# Altium schematic sheet CHANNEL_RELAY_CARD.SchDoc
size A4
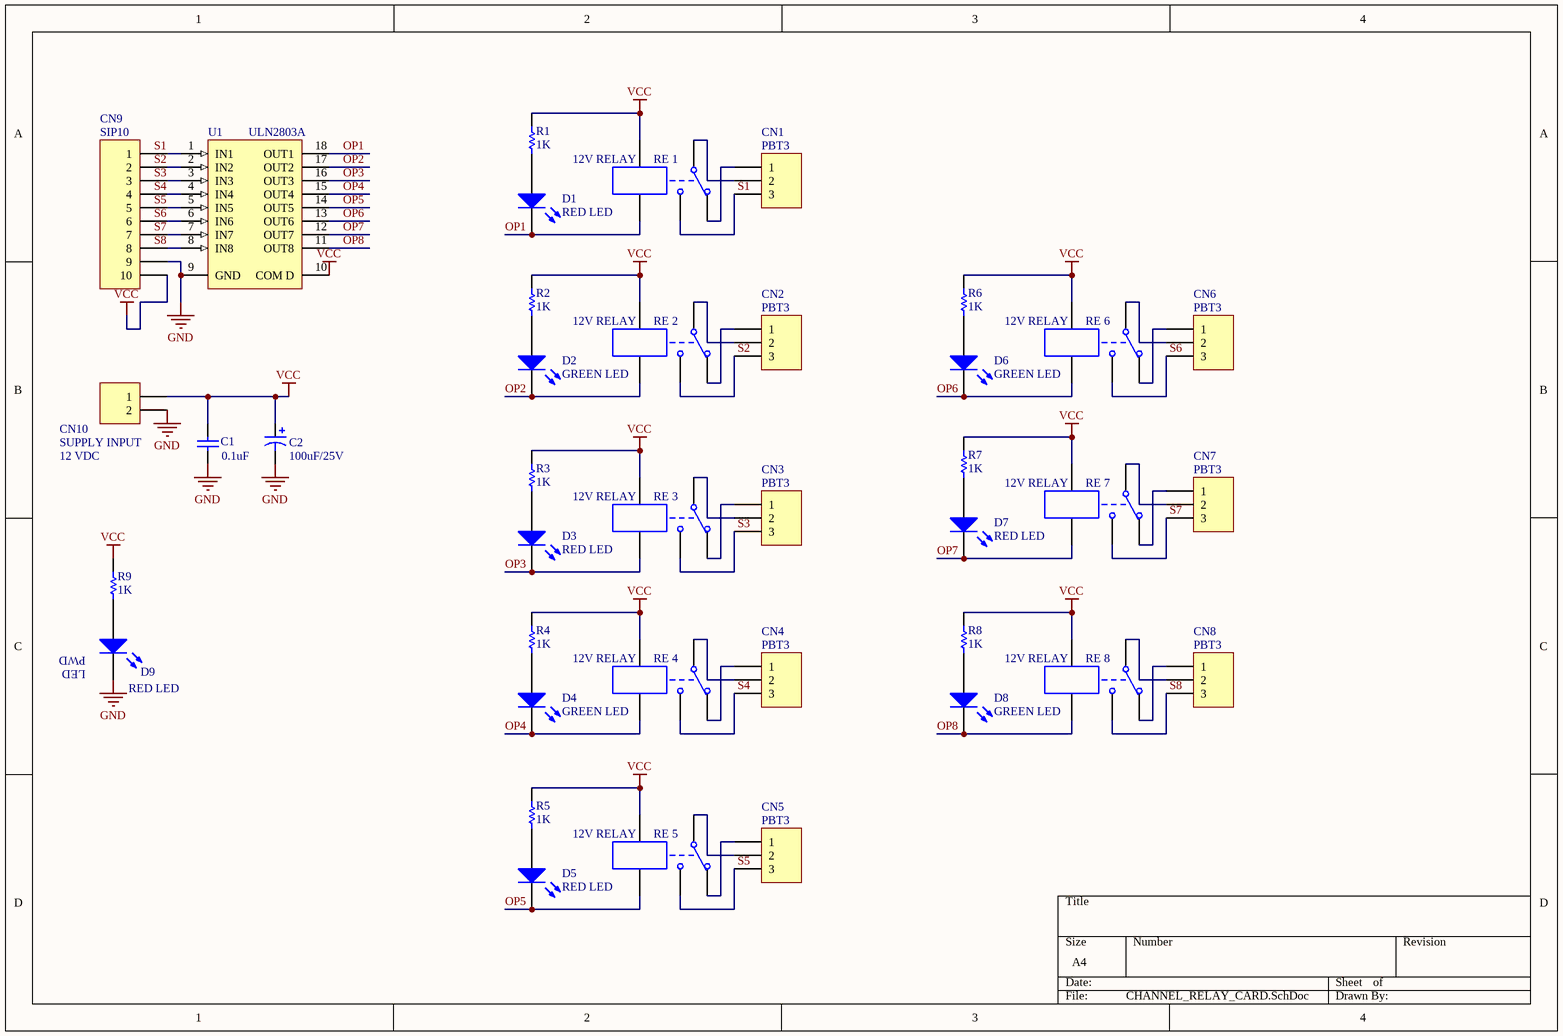
[diagram p0: CHANNEL_RELAY_CARD.SchDoc]

## Parts
C1  value 0.1uF  [RAD-0.3]  (hidden comment: Cap)
C2  value 100uF/25V  [RB7.6-15]  (hidden comment: Cap Pol1)
CN1  PBT3  [HDR1X3]
CN2  PBT3  [HDR1X3]
CN3  PBT3  [HDR1X3]
CN4  PBT3  [HDR1X3]
CN5  PBT3  [HDR1X3]
CN6  PBT3  [HDR1X3]
CN7  PBT3  [HDR1X3]
CN8  PBT3  [HDR1X3]
CN9  SIP10  [HDR1X10H]
CN10  SUPPLY INPUT  [HDR1X2]
D1  RED LED  [5mm_LED]
D2  GREEN LED  [5mm_LED]
D3  RED LED  [5mm_LED]
D4  GREEN LED  [5mm_LED]
D5  RED LED  [5mm_LED]
D6  GREEN LED  [5mm_LED]
D7  RED LED  [5mm_LED]
D8  GREEN LED  [5mm_LED]
D9  RED LED  [5mm_LED]
R1  1K  [Res 0.25W]
R2  1K  [Res 0.25W]
R3  1K  [Res 0.25W]
R4  1K  [Res 0.25W]
R5  1K  [Res 0.25W]
R6  1K  [Res 0.25W]
R7  1K  [Res 0.25W]
R8  1K  [Res 0.25W]
R9  1K  [Res 0.25W]
RE_1  12V RELAY  [Relay_Sugarcube]
RE_2  12V RELAY  [Relay_Sugarcube]
RE_3  12V RELAY  [Relay_Sugarcube]
RE_4  12V RELAY  [Relay_Sugarcube]
RE_5  12V RELAY  [Relay_Sugarcube]
RE_6  12V RELAY  [Relay_Sugarcube]
RE_7  12V RELAY  [Relay_Sugarcube]
RE_8  12V RELAY  [Relay_Sugarcube]
U1  ULN2803A  [A18]

## Nets
GND: C1.1 C2.2 CN9.9 CN10.2 D9.2(K) U1.9(GND)
VCC: C1.2 C2.1 CN9.10 CN10.1 R1.2 R2.2 R3.2 R4.2 R5.2 R6.2 R7.2 R8.2 R9.2 RE_1.4 RE_2.4 RE_3.4 RE_4.4 RE_5.4 RE_6.4 RE_7.4 RE_8.4 U1.10(COM_D)
 S1: CN1.3 RE_1.3
 S2: CN2.3 RE_2.3
 S3: CN3.3 RE_3.3
 S4: CN4.3 RE_4.3
 S5: CN5.3 RE_5.3
 S6: CN6.3 RE_6.3
 S7: CN7.3 RE_7.3
 S8: CN8.3 RE_8.3
OP1: D1.2(K) RE_1.5 U1.18(OUT1)
OP2: D2.2(K) RE_2.5 U1.17(OUT2)
OP3: D3.2(K) RE_3.5 U1.16(OUT3)
OP4: D4.2(K) RE_4.5 U1.15(OUT4)
OP5: D5.2(K) RE_5.5 U1.14(OUT5)
OP6: D6.2(K) RE_6.5 U1.13(OUT6)
OP7: D7.2(K) RE_7.5 U1.12(OUT7)
OP8: D8.2(K) RE_8.5 U1.11(OUT8)
NetCN1_1: CN1.1 RE_1.2
NetCN1_2: CN1.2 RE_1.1
NetCN2_1: CN2.1 RE_2.2
NetCN2_2: CN2.2 RE_2.1
NetCN3_1: CN3.1 RE_3.2
NetCN3_2: CN3.2 RE_3.1
NetCN4_1: CN4.1 RE_4.2
NetCN4_2: CN4.2 RE_4.1
NetCN5_1: CN5.1 RE_5.2
NetCN5_2: CN5.2 RE_5.1
NetCN6_1: CN6.1 RE_6.2
NetCN6_2: CN6.2 RE_6.1
NetCN7_1: CN7.1 RE_7.2
NetCN7_2: CN7.2 RE_7.1
NetCN8_1: CN8.1 RE_8.2
NetCN8_2: CN8.2 RE_8.1
NetCN9_1: CN9.1 U1.1(IN1)
NetCN9_2: CN9.2 U1.2(IN2)
NetCN9_3: CN9.3 U1.3(IN3)
NetCN9_4: CN9.4 U1.4(IN4)
NetCN9_5: CN9.5 U1.5(IN5)
NetCN9_6: CN9.6 U1.6(IN6)
NetCN9_7: CN9.7 U1.7(IN7)
NetCN9_8: CN9.8 U1.8(IN8)
NetD1_1: D1.1(A) R1.1
NetD2_1: D2.1(A) R2.1
NetD3_1: D3.1(A) R3.1
NetD4_1: D4.1(A) R4.1
NetD5_1: D5.1(A) R5.1
NetD6_1: D6.1(A) R6.1
NetD7_1: D7.1(A) R7.1
NetD8_1: D8.1(A) R8.1
NetD9_1: D9.1(A) R9.1

## Notes on the sheet
- 12 VDC
- (near D9) PWD
- (near D9) LED
- Labels drawn without touching a wire or pin: S1, S2, S3, S4, S5, S6, S7, S8

## Library data of the parts
C1 = Cap: Capacitor; Published: 8-Jun-2000; LatestRevisionDate: 17-Jul-2002; LatestRevisionNote: Re-released for DXP Platform.; PackageReference: RAD-0.3; Publisher: Altium Limited
C2 = Cap Pol1: Polarized Capacitor (Radial); Published: 8-Jun-2000; LatestRevisionDate: 17-Jul-2002; LatestRevisionNote: Re-released for DXP Platform.; PackageReference: RB7.6-15; Publisher: Altium Limited
CN1-CN8 = Header 3: Header, 3-Pin; LatestRevisionDate: 17-Jul-2002; LatestRevisionNote: Re-released for DXP Platform.; Publisher: Altium Limited
CN9 = Header 10H: Header, 10-Pin, Right Angle; LatestRevisionDate: 17-Jul-2002; LatestRevisionNote: Re-released for DXP Platform.; Publisher: Altium Limited
CN10 = Header 2: Header, 2-Pin; LatestRevisionDate: 17-Jul-2002; LatestRevisionNote: Re-released for DXP Platform.; Publisher: Altium Limited
D1 D3 D5 D7 D9 = LED_THT: Color: Red
D2 D4 D6 D8 = LED_THT: Color: Red
R1-R9 = Resistor_THT: Value: 1K
RE_1-RE_8 = Relay Sugacube: Coil Voltage: 12V
U1 = ULN2803A: High-Voltage, High-Current Darlington Array; Published: 13-Oct-2000; LatestRevisionDate: 06-Jun-2005; LatestRevisionNote: Stylized 3D Model Added.; DatasheetVersion: 1999; PackageVersion: 1999; PackageReference: A18; Publisher: Altium Limited; PackageDescription: DIP; 18 Leads; Row Spacing 7.62 mm; Pitch 2.54 mm; ComponentLink1Description: Manufacturer Link; ComponentLink1URL: http://www.allegromicro.com/